# EAGLE schematic esp8266 (EAGLE 7.3.0)
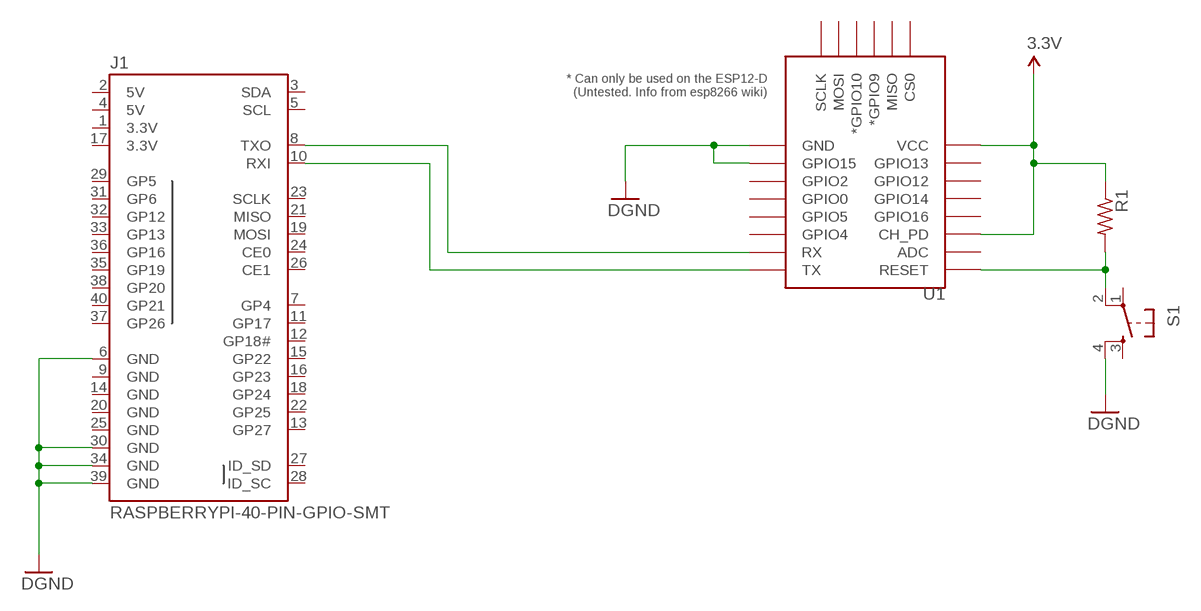
[diagram p0: schematic, sheet 1]

## Parts
J1  RASPBERRYPI-40-PIN-GPIO-SMT  [2X20-SHROUDED-SMT]
R1  R-US_0204/2V  [0204V]
S1  TAC_SWITCHPTH  [TACTILE-PTH]
U1  ESP12ESMD  [ESP12E-SMD]

## Nets
3.3V: R1.1 U1.CH_PD U1.VCC
GND: J1.6(GND) J1.30(GND) J1.34(GND) J1.39(GND) S1.4 U1.GND U1.GPIO15 ; supply symbol labelled DGND
N$1: J1.8(TXO) U1.RXD0(RX)
N$2: J1.10(RXI) U1.TXD0(TX)
N$3: R1.2 S1.2 U1.RESET
Unconnected: J1.3(SDA) J1.5(SCL) J1.7(GP4) J1.11(GP17) J1.12(GP18#) J1.13(GP27) J1.15(GP22) J1.16(GP23) J1.18(GP24) J1.19(MOSI) J1.21(MISO) J1.22(GP25) J1.23(SCLK) J1.24(CE0) J1.26(CE1) J1.27(ID_SD) J1.28(ID_SC) J1.29(GP5) J1.31(GP6) J1.32(GP12) J1.33(GP13) J1.35(GP19) J1.36(GP16) J1.37(GP26) J1.38(GP20) J1.40(GP21) S1.1 S1.3 U1.ADC U1.CS0 U1.GPIO0 U1.GPIO2 U1.GPIO4 U1.GPIO5 U1.GPIO9(*GPIO9) U1.GPIO10(*GPIO10) U1.GPIO12 U1.GPIO13 U1.GPIO14 U1.GPIO16 U1.MISO U1.MOSI U1.SCLK

## Power pins joined to a net without a drawn wire
3.3V: J1.1(3.3V) J1.17(3.3V)
5V: J1.2(5V) J1.4(5V)
GND: J1.9(GND) J1.14(GND) J1.20(GND) J1.25(GND)

## Library data of the parts
J1 = SparkFun-Boards:RASPBERRYPI-40-PIN-GPIO: Second Generation Raspberry Pi GPIO Header 2x20 pin connector, as found on B, B+, A+ models.; PROD_ID: CONN-13143
R1 = adafruit:R-US_: RESISTOR, American symbol
S1 = SparkFun-Retired:TAC_SWITCH: Momentary Switch Button commonly used for reset or general input. Spark Fun Electronics SKU : COM-00097 SMT- SWCH-08247
U1 = esp8266modules:ESP12E: ESP12E Module